# Altium schematic sheet XBEE.SchDoc
size 420 x 297 mm; SheetNumber: 14; SheetTotal: 19
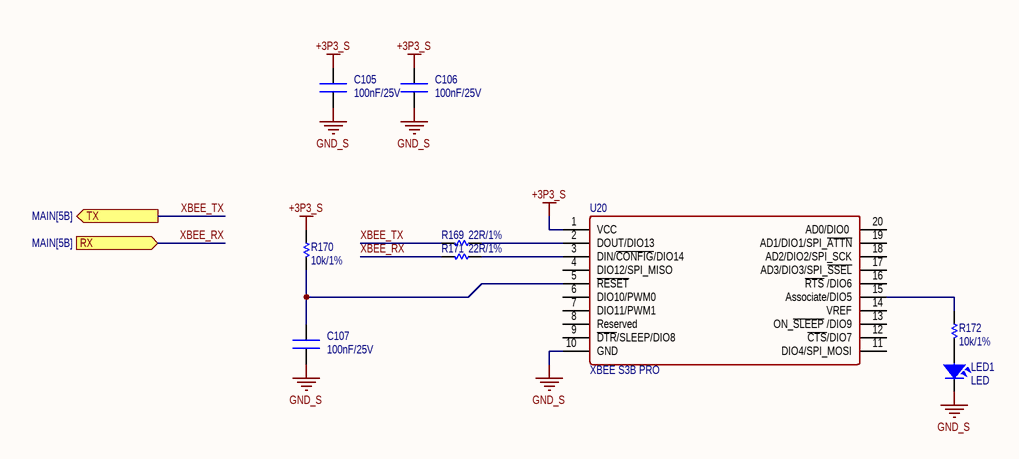
[diagram p0: XBEE.SchDoc]

## Parts
C105  100nF/25V  [CN-SMD-0603]
C106  100nF/25V  [CN-SMD-0603]
C107  100nF/25V  [CN-SMD-0603]
LED1  LED  [LED-0603-RED]
R169  22R/1%  [RES-SMD-0603]
R170  10k/1%  [RES-SMD-0603]
R171  22R/1%  [RES-SMD-0603]
R172  10k/1%  [RES-SMD-0603]
U20  XBEE S3B PRO  [XBEE S3B PRO DIP]

## Ports
RX (in, see MAIN[5B]), TX (out, see MAIN[5B])

## Nets
+3P3_S: C105.2 C106.2 R170.1 U20.1(VCC)
GND_S: C105.1 C106.1 C107.1 LED1.2 U20.10(GND)
XBEE_RX: R171.2 ; port RX
XBEE_TX: R169.2 ; port TX
NetC107_2: C107.2 R170.2 U20.5(~{RESET})
NetLED1_1: LED1.1 R172.2
NetR169_1: R169.1 U20.2(DOUT/DIO13)
NetR171_1: R171.1 U20.3(DIN/~{CONFIG}/DIO14)
NetR172_1: R172.1 U20.15(Associate/DIO5)

Not connected (* = marked no-connect by the designer): U20 4(DIO12/SPI_MISO) 6(DIO10/PWM0) 7(DIO11/PWM1) 8(Reserved) 9(~{DTR}/SLEEP/DIO8) 11(DIO4/SPI_MOSI) 12(~{CTS}/DIO7) 13(ON_~{SLEEP}_/DIO9) 14(VREF) 16(~{RTS}_/DIO6) 17(AD3/DIO3/SPI_~{SSEL}) 18(AD2/DIO2/SPI_SCK) 19(AD1/DIO1/SPI_~{ATTN}) 20(AD0/DIO0_)

## Notes on the sheet
- Project:
- Sub-system:
- Design by:
- Sheet title:
- Sheet
- of
- Checked by:
- Approved by:
- Document No:
- Revision:
- Size:
- Date:

## Library data of the parts
C105-C107 = CN: CAP CER 0.1UF 25V X7R 0603; PN: CL10B104KA8NNNC
LED1 = LED SMD: LED RED CLEAR 0603 SMD; PN: 150060RS75000
R169 R171 = Res-SMD: RES SMD 22 OHM 1% 1/10W 0603; PN: ERJ-3EKF22R0V
R170 R172 = Res-SMD: RES SMD 10K OHM 1% 1/10W 0603; Manufacturer: Generic Components; PN: ERJ-3EKF1002V; Class: Passive; Publisher: Altium Hobart Technology Centre